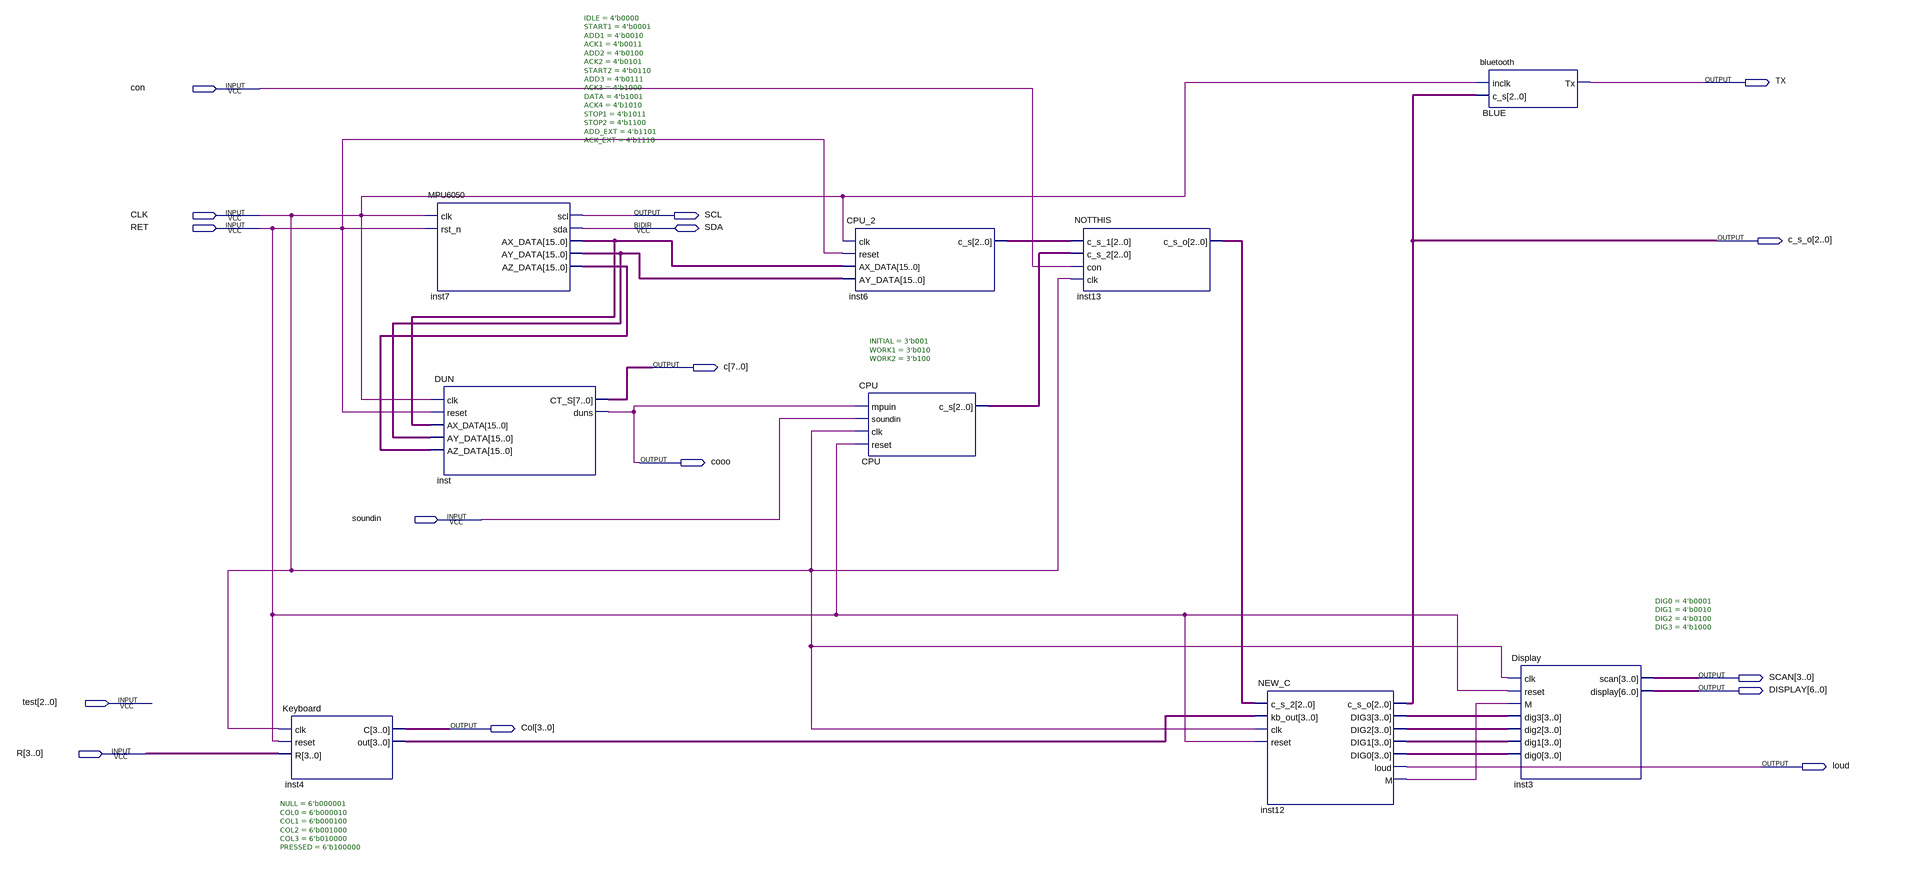
[diagram p0: schematic sheet]
// Quartus schematic Human_moudel.bdf as structural Verilog: 9 symbols, 16 pins
module Human_moudel (
  input  con,
  input  CLK,
  input  RET,
  input  soundin,
  input  [2:0] test,
  input  [3:0] R,
  inout  SDA,
  output TX,
  output SCL,
  output [2:0] c_s_o,
  output [7:0] c,
  output cooo,
  output [3:0] SCAN,
  output [6:0] DISPLAY,
  output [3:0] Col,
  output loud
);

  wire inst12_m;
  wire [2:0] CPU_c_s, inst6_c_s, inst13_c_s_o;
  wire [3:0] inst4_out, inst12_dig0, inst12_dig1, inst12_dig2, inst12_dig3;
  wire [15:0] inst7_ax_data, inst7_ay_data, inst7_az_data;

  Keyboard #(.NULL(6'b000001), .COL0(6'b000010), .COL1(6'b000100), .COL2(6'b001000), .COL3(6'b010000), .PRESSED(6'b100000)) inst4 (
    .clk(CLK), .reset(RET), .R(R), .C(Col), .out(inst4_out));
  MPU6050 #(.IDLE(4'b0000), .START1(4'b0001), .ADD1(4'b0010), .ACK1(4'b0011), .ADD2(4'b0100), .ACK2(4'b0101), .START2(4'b0110), .ADD3(4'b0111), .ACK3(4'b1000), .DATA(4'b1001), .ACK4(4'b1010), .STOP1(4'b1011), .STOP2(4'b1100), .ADD_EXT(4'b1101), .ACK_EXT(4'b1110)) inst7 (
    .clk(CLK), .rst_n(RET), .scl(SCL), .AX_DATA(inst7_ax_data), .AY_DATA(inst7_ay_data),
    .AZ_DATA(inst7_az_data), .sda(SDA));
  DUN inst (
    .clk(CLK), .reset(RET), .AX_DATA(inst7_ax_data), .AY_DATA(inst7_ay_data), .AZ_DATA(inst7_az_data),
    .CT_S(c), .duns(cooo));
  CPU_2 inst6 (.clk(CLK), .reset(RET), .AX_DATA(inst7_ax_data), .AY_DATA(inst7_ay_data), .c_s(inst6_c_s));
  CPU #(.INITIAL(3'b001), .WORK1(3'b010), .WORK2(3'b100)) CPU (
    .mpuin(cooo), .soundin(soundin), .clk(CLK), .reset(RET), .c_s(CPU_c_s));
  NOTTHIS inst13 (.c_s_1(inst6_c_s), .c_s_2(CPU_c_s), .con(con), .clk(CLK), .c_s_o(inst13_c_s_o));
  NEW_C inst12 (
    .c_s_2(inst13_c_s_o), .kb_out(inst4_out), .clk(CLK), .reset(RET), .c_s_o(c_s_o), .DIG3(inst12_dig3),
    .DIG2(inst12_dig2), .DIG1(inst12_dig1), .DIG0(inst12_dig0), .loud(loud), .M(inst12_m));
  bluetooth BLUE (.inclk(CLK), .c_s(c_s_o), .Tx(TX));
  Display #(.DIG0(4'b0001), .DIG1(4'b0010), .DIG2(4'b0100), .DIG3(4'b1000)) inst3 (
    .clk(CLK), .reset(RET), .M(inst12_m), .dig3(inst12_dig3), .dig2(inst12_dig2), .dig1(inst12_dig1),
    .dig0(inst12_dig0), .scan(SCAN), .display(DISPLAY));
endmodule
